# EAGLE schematic SpiCurrent-Old-WithShunt (EAGLE 7.2.0)
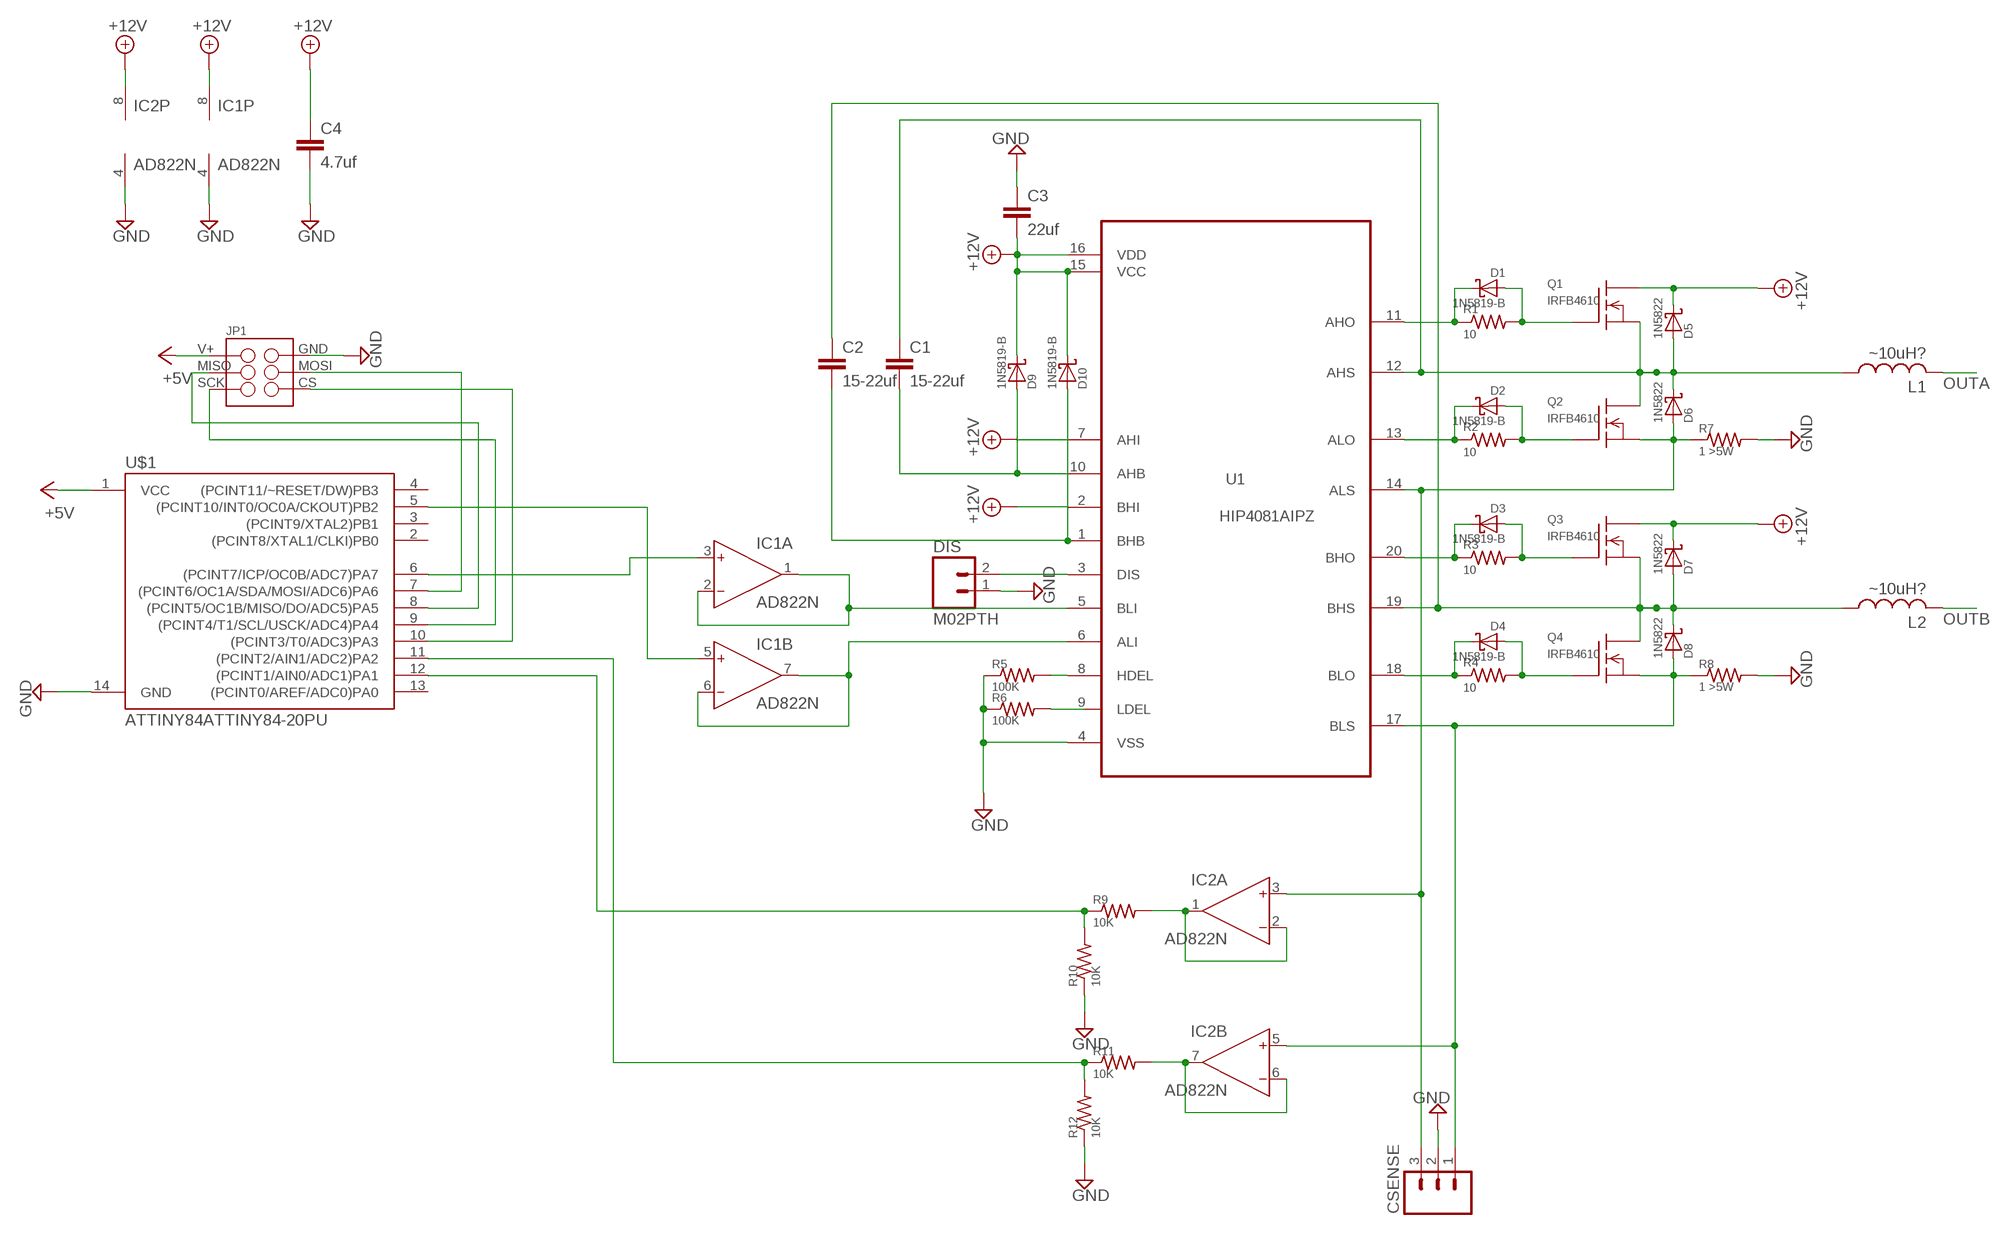
[diagram p0: schematic, sheet 1]

## Parts
C1  15-22uf  C-EU050-055X075  [C050-055X075]
C2  15-22uf  C-EU050-055X075  [C050-055X075]
C3  22uf  C-EU050-055X075  [C050-055X075]
C4  4.7uf  C-EU050-055X075  [C050-055X075]
CSENSE  M03PTH  [1X03]
D1  1N5819-B  [DO41-7.6]
D2  1N5819-B  [DO41-7.6]
D3  1N5819-B  [DO41-7.6]
D4  1N5819-B  [DO41-7.6]
D5  1N5822  1N5819-B  [DO41-7.6]
D6  1N5822  1N5819-B  [DO41-7.6]
D7  1N5822  1N5819-B  [DO41-7.6]
D8  1N5822  1N5819-B  [DO41-7.6]
D9  1N5819-B  [DO41-7.6]
D10  1N5819-B  [DO41-7.6]
DIS  M02PTH  [1X02]
IC1  AD822N  [DIL08]
IC2  AD822N  [DIL08]
JP1  M03X2SHROUD  [2X3-SPI-SHROUDED]
L1  ~10uH?  L-USTJ6-U2  [TJ6-U2]
L2  ~10uH?  L-USTJ6-U2  [TJ6-U2]
Q1  IRFB4610  [TO220]
Q2  IRFB4610  [TO220]
Q3  IRFB4610  [TO220]
Q4  IRFB4610  [TO220]
R1  10  R-US_0207/10  [0207/10]
R2  10  R-US_0207/10  [0207/10]
R3  10  R-US_0207/10  [0207/10]
R4  10  R-US_0207/10  [0207/10]
R5  100K  R-US_0207/10  [0207/10]
R6  100K  R-US_0207/10  [0207/10]
R7  1 >5W  R-US_VTA54  [VTA54]
R8  1 >5W  R-US_VTA54  [VTA54]
R9  10K  R-US_0207/10  [0207/10]
R10  10K  R-US_0207/10  [0207/10]
R11  10K  R-US_0207/10  [0207/10]
R12  10K  R-US_0207/10  [0207/10]
U1  HIP4081AIPZ  [DIP254P762X533-20]
U$1  ATTINY84ATTINY84-20PU  [DIL14]

## Nets
+5V: JP1.1 U$1.1(VCC)
+12V: C3.2 C4.1 D5.C D7.C D9.C D10.C IC1.8(P:V+) IC2.8(P:V+) Q1.2(D) Q3.2(D) U1.2(BHI) U1.7(AHI) U1.15(VCC) U1.16(VDD)
GND: C3.1 C4.2 CSENSE.2 DIS.1 IC1.4(P:V-) IC2.4(P:V-) JP1.2 R5.1 R6.1 R7.2 R8.2 R10.1 R12.1 U1.4(VSS) U$1.14(GND)
N$1: IC1.1(A:OUT) IC1.2(A:IN-) U1.5(BLI)
N$2: IC1.6(B:IN-) IC1.7(B:OUT) U1.6(ALI)
N$3: D3.C R3.1 U1.20(BHO)
N$4: D3.A Q3.1(G) R3.2
N$5: D4.C R4.1 U1.18(BLO)
N$6: D4.A Q4.1(G) R4.2
N$7: D2.C R2.1 U1.13(ALO)
N$8: D2.A Q2.1(G) R2.2
N$9: D1.C R1.1 U1.11(AHO)
N$10: D1.A Q1.1(G) R1.2
N$11: C1.1 D5.A D6.C L1.1 Q1.3(S) Q2.2(D) U1.12(AHS)
N$12: R5.2 U1.8(HDEL)
N$13: R6.2
N$14: C2.1 D7.A D8.C L2.1 Q3.3(S) Q4.2(D) U1.19(BHS)
N$15: CSENSE.3 D6.A IC2.3(A:IN+) Q2.3(S) R7.1 U1.14(ALS)
N$16: CSENSE.1 D8.A IC2.5(B:IN+) Q4.3(S) R8.1 U1.17(BLS)
N$17: C1.2 D9.A U1.10(AHB)
N$18: C2.2 D10.A U1.1(BHB)
N$19: DIS.2 U1.3(DIS)
N$20: JP1.4 U$1.7((PCINT6/OC1A/SDA/MOSI/ADC6)PA6)
N$21: JP1.3 U$1.8((PCINT5/OC1B/MISO/DO/ADC5)PA5)
N$22: JP1.5 U$1.9((PCINT4/T1/SCL/USCK/ADC4)PA4)
N$23: JP1.6 U$1.10((PCINT3/T0/ADC3)PA3)
N$24: IC1.5(B:IN+) U$1.5((PCINT10/INT0/OC0A/CKOUT)PB2)
N$25: IC1.3(A:IN+) U$1.6((PCINT7/ICP/OC0B/ADC7)PA7)
N$26: R9.1 R10.2 U$1.12((PCINT1/AIN0/ADC1)PA1)
N$28: IC2.1(A:OUT) IC2.2(A:IN-) R9.2
N$29: IC2.6(B:IN-) IC2.7(B:OUT) R11.2
N$30: R11.1 R12.2 U$1.11((PCINT2/AIN1/ADC2)PA2)
OUTA: L1.2
OUTB: L2.2
Unconnected: U1.9(LDEL) U$1.2((PCINT8/XTAL1/CLKI)PB0) U$1.3((PCINT9/XTAL2)PB1) U$1.4((PCINT11/~RESET/DW)PB3) U$1.13((PCINT0/AREF/ADC0)PA0)

## Library data of the parts
C1-C4 = rcl:C-EU: CAPACITOR, European symbol
CSENSE = SparkFun-Connectors:M03: Header 3 Standard 3-pin 0.1" header. Use with straight break away headers (SKU : PRT-00116), right angle break away headers (PRT-00553), swiss pins (PRT-00743), machine pins (PRT-00117), and female headers (PRT-00115). Molex polarized connector foot print use with SKU : PRT-08232 with associated crimp pins and housings.
D1-D10 = diode-custom:1N581*: 1.0A SCHOTTKY BARRIER RECTIFIER Source: http://www.diodes.com/datasheets/ds23001.pdf
DIS = SparkFun-Connectors:M02: Standard 2-pin 0.1" header. Use with - straight break away headers ( PRT-00116) - right angle break away headers (PRT-00553) - swiss pins (PRT-00743) - machine pins (PRT-00117) - female headers (PRT-00115) Molex polarized connector foot print use with: PRT-08233 with associated crimp pins and housings. 2.54_SCREWTERM for use with PRT-10571. 3.5mm Screw Terminal footprints for PRT-08084 5mm Screw Terminal footprints for use with PRT-08432
IC1 IC2 = analog-devices:AD822: Single-Supply, Rail-to-Rail Low Power FET-Input Op Amp Source: http://www.analog.com/static/imported-files/data_sheets/AD822.pdf; OC_FARNELL: 1438581; OC_NEWARK: unknown
JP1 = CustomParts:M03X2: 2x3 .1" header. Shrouded, with keying- CONN-10681 SMT- CONN-11415 Pogo pins- HW-11044; PROD_ID: CONN-10681
L1 L2 = rcl:L-US: INDUCTOR, American symbol
Q1-Q4 = CustomParts:IRFB4610: N-Channel Enhancement MOSFET (HEXFET); 73V; 100A; 11mOhm
R1-R4 = resistor:R-US_: RESISTOR, American symbol
R5-R12 = resistor-custom:R-US_: RESISTOR, American symbol
U1 = Intersil_By_element14_Batch_1:HIP4081AIPZ: Bridge FET Driver; MPN: HIP4081AIPZ; OC_FARNELL: 9664130; OC_NEWARK: 57K3817; PACKAGE: DIP-20; SUPPLIER: INTERSIL
U$1 = SparkFun-DigitalIC:ATTINY84: Atmel 14-pin 2/4/8kB flash uC